# EAGLE board ESP32S3_DevBoard (EAGLE 9.6.2)
ERSTELLT_NAME: ESP32S3_DevBoard; PCBNAME: ESP32S3_DevBoard; PCBNUMMER: 20240115; PROJEKTNAME: ESP32S3_DevBoard; VERSION: v1.0
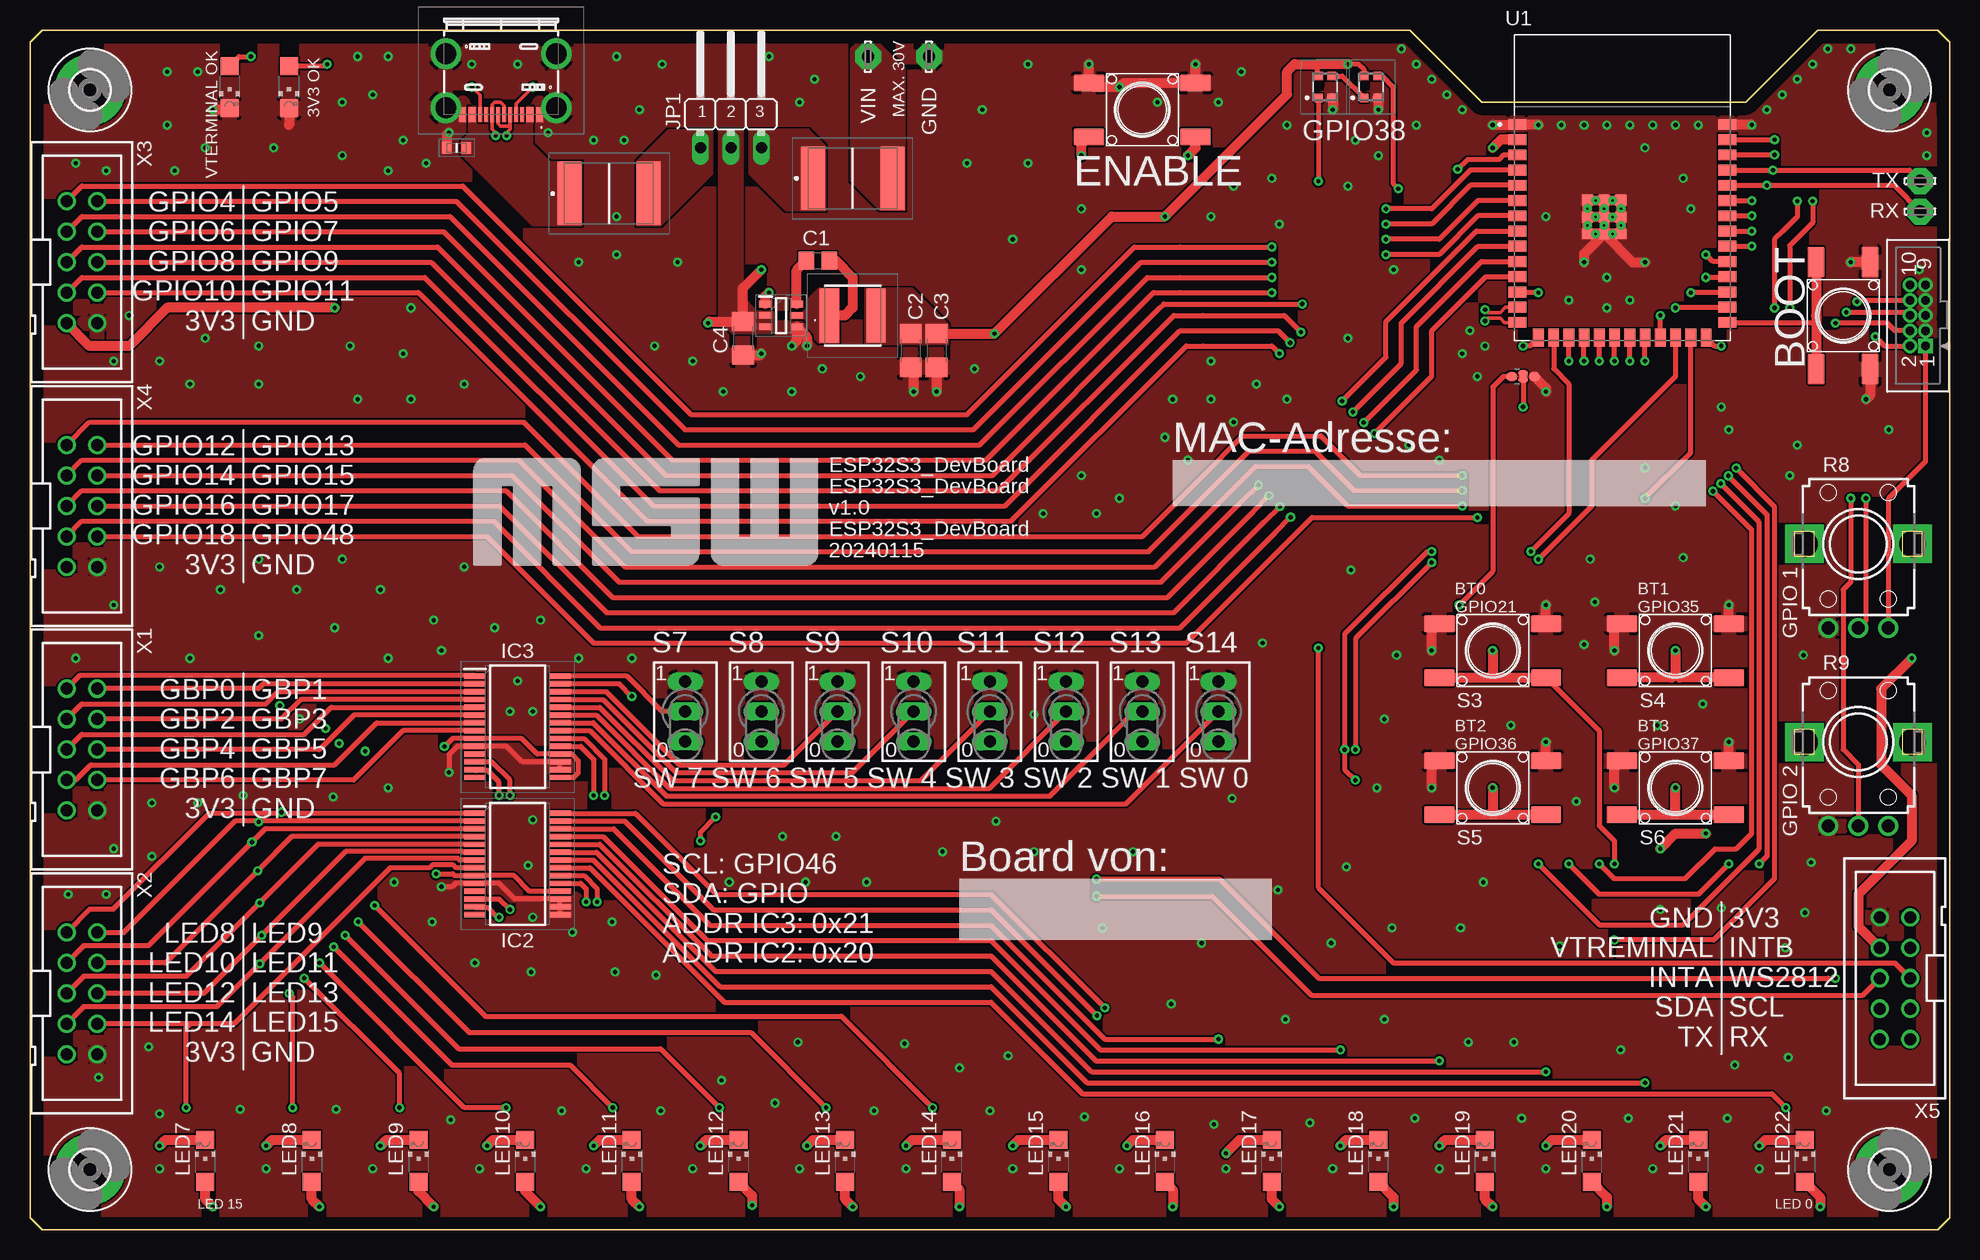
[diagram p3: board, top side]
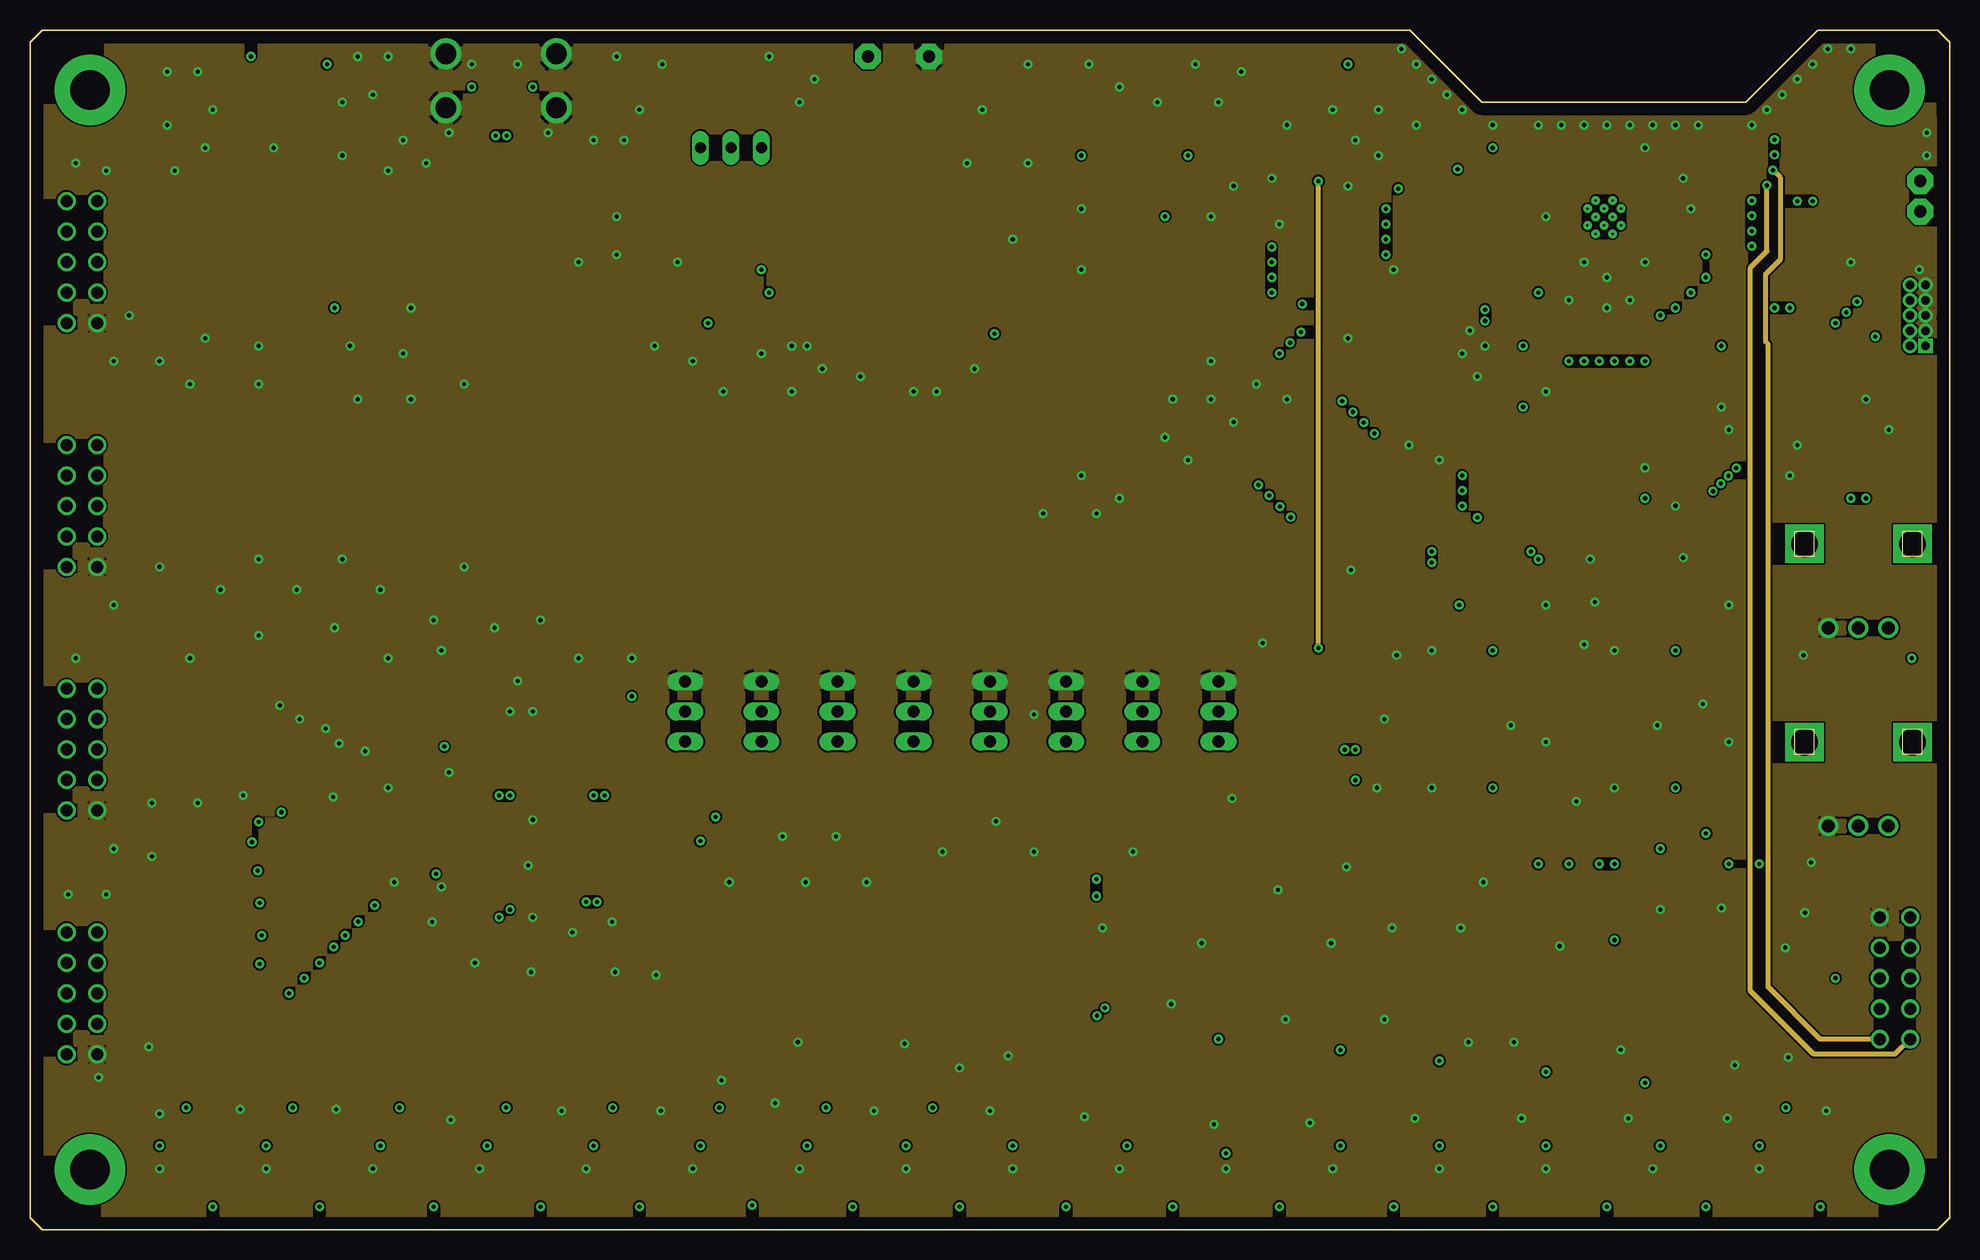
[diagram p4: board, inner layer Route2]
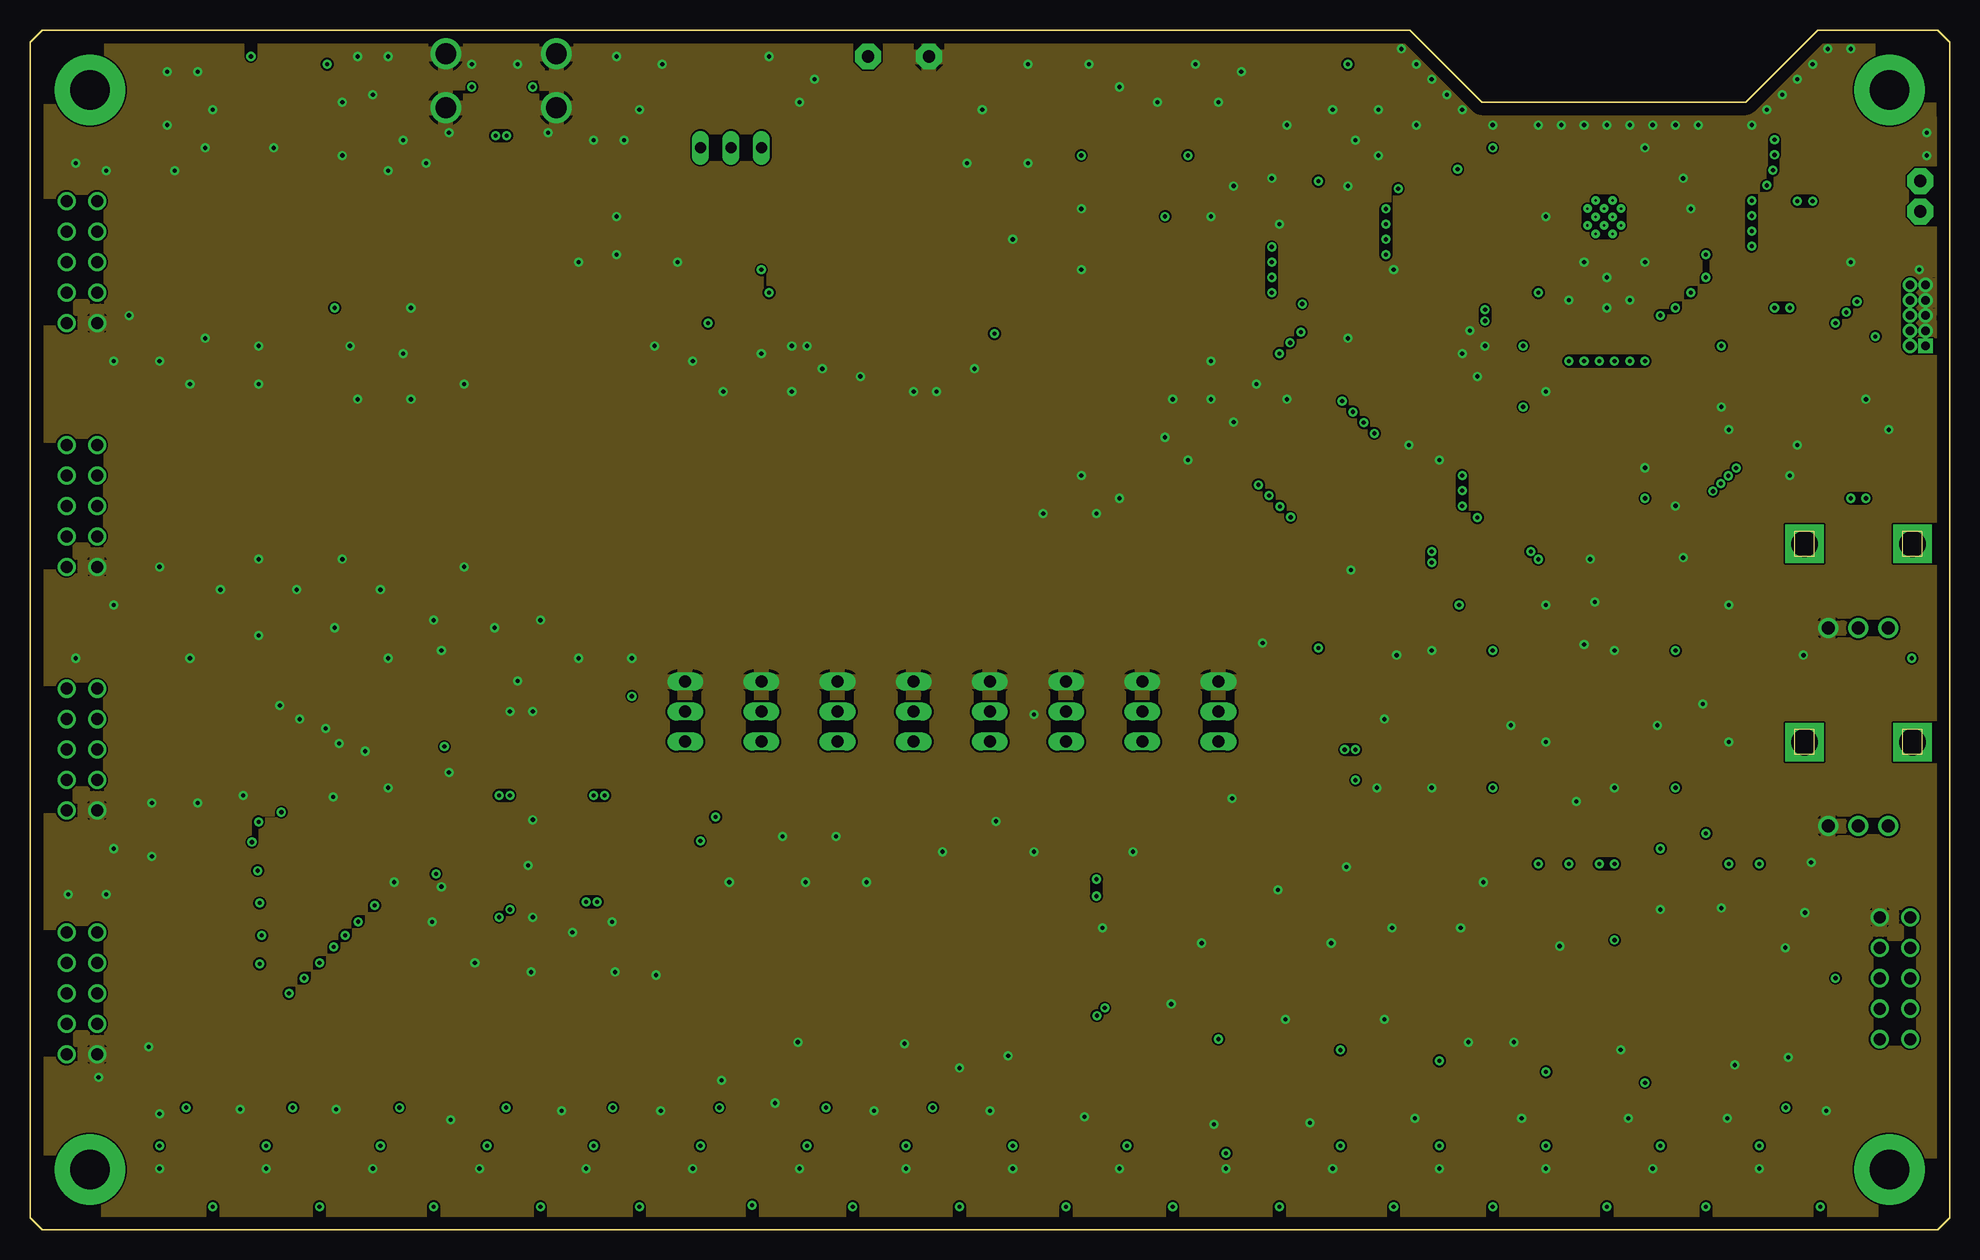
[diagram p5: board, inner layer Route15]
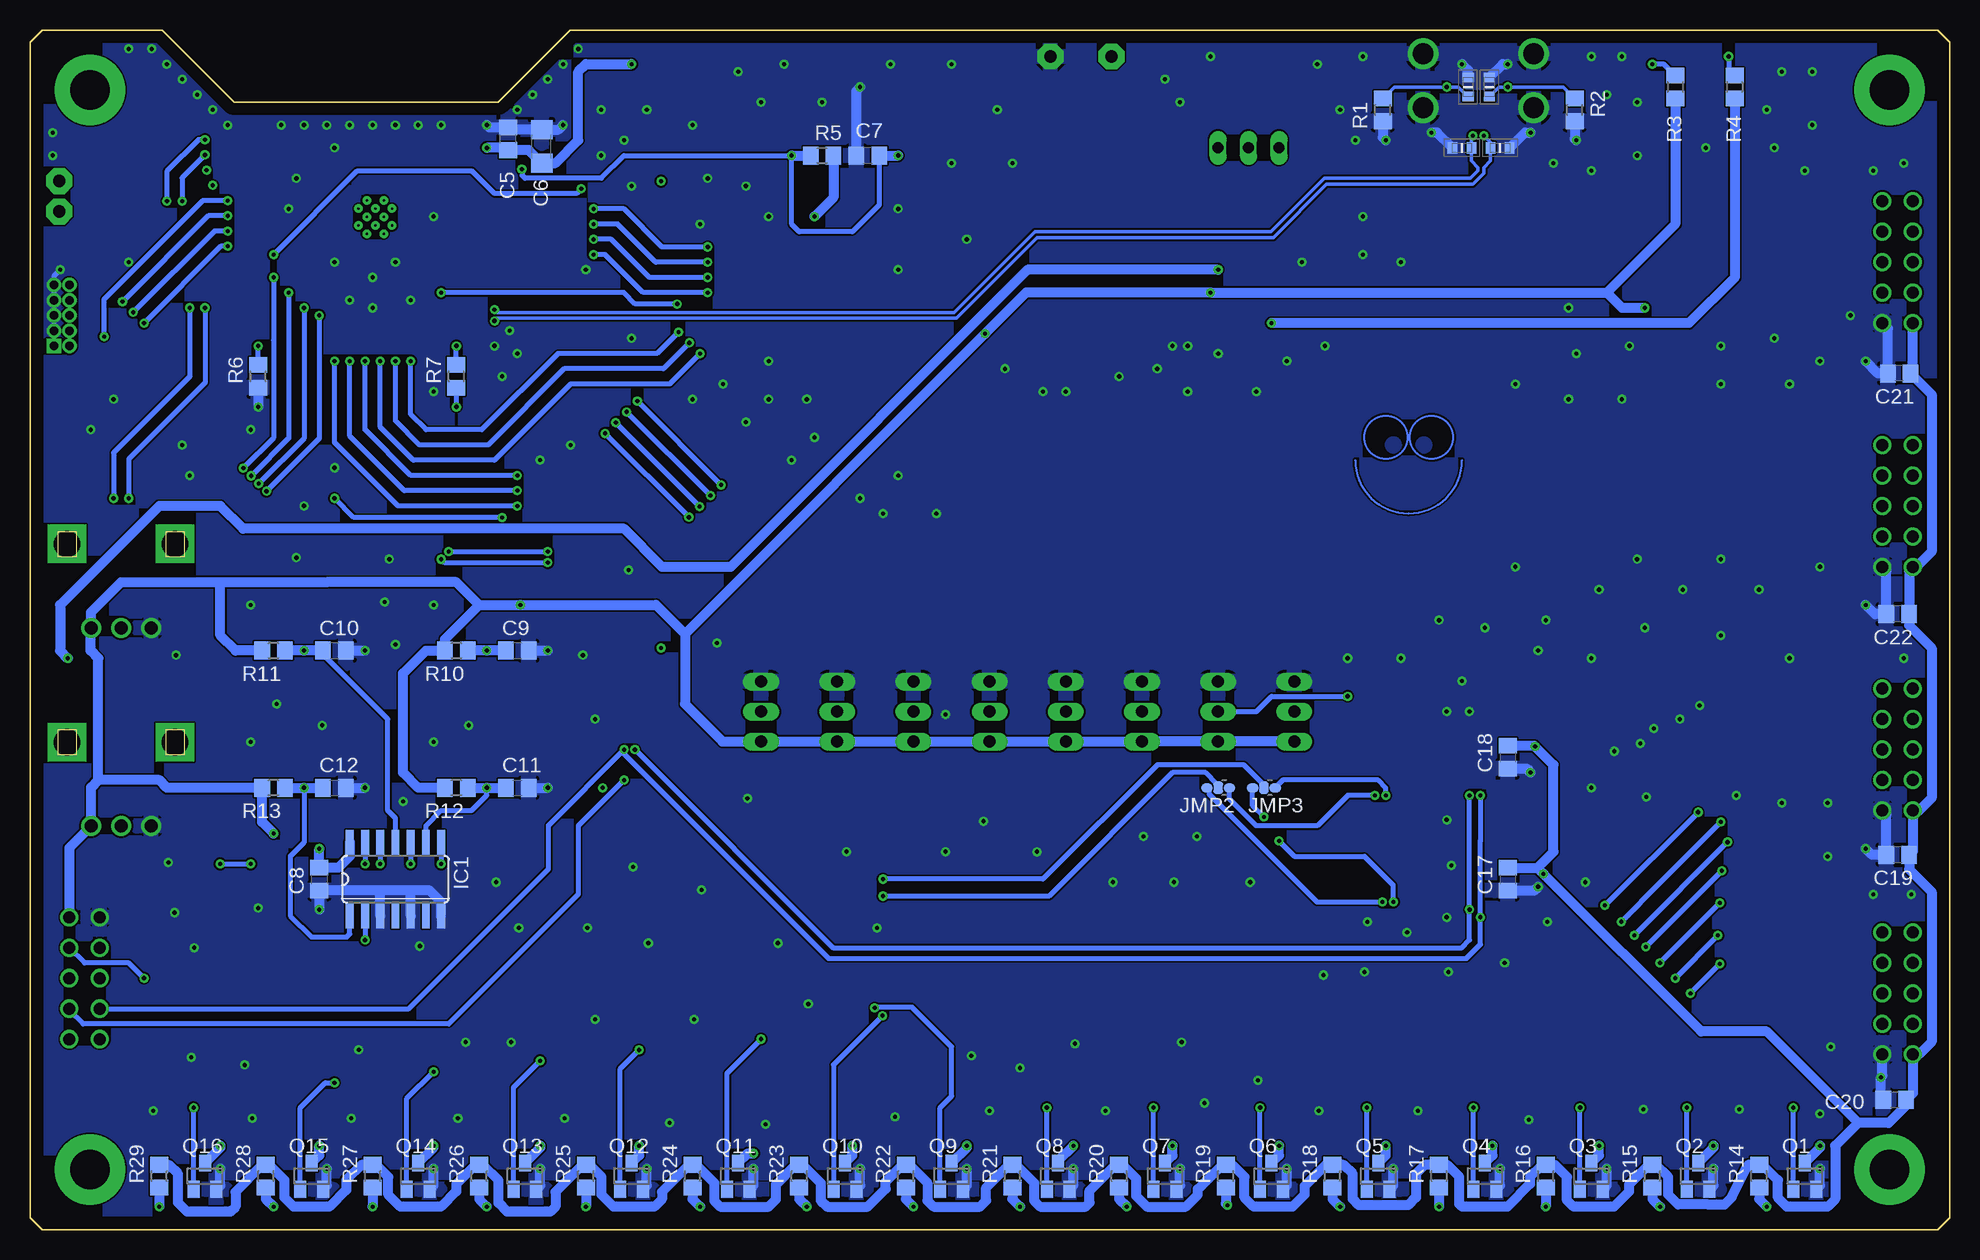
[diagram p6: board, bottom side, seen from below]

Size 160 x 100 mm. Coordinates in mm from the lower left corner, seen from the top.
Outline: 159,0 160,1 160,76 160,93 160,99 159,100 150,100 149,100 143,94 122,94 121,94 120,95 115,100 1,100 0,99 0,1 1,0 159,0
Copper layers (1+2*15+16): Top 0.035mm / dielectric 0.2104mm / Route2 0.0152mm / dielectric 1.065mm / Route15 0.0152mm / dielectric 0.2104mm / Bottom 0.035mm
Design rules "default *": minimum track width 6mil, minimum drill 0.35mm, track to track 6mil, track to pad 6mil, pad to pad 6mil, via to via 6mil, smd to smd 6mil, copper to edge 40mil, drill to drill 6mil, minimum pad ring 10mil, minimum via ring 8mil, stop-mask expansion 4mil, vias tented up to drill 22mil, thermal gap 10mil
Net classes: 1 diff pairs: width 0.203 mm, clearance 0.178 mm

## Footprints (pad centres in the part's own frame; a part is rotated, then mirrored left to right if it is on the bottom)
C0805 = smd 1.3 x 1.5: 1 -0.95,0; 2 0.95,0
C1206 = smd 1.6 x 1.8: 1 -1.4,0; 2 1.4,0
DIONC1608X70N = smd 0.8 x 0.95: 1 -0.8,0; 2 0.8,0
2920L030DR = smd 2 x 5.3: 1 -3.3,0; 2 3.3,0
LSP10 = drill 1.016 pad 2.159 octagon: MP 0,0
3,3-PAD = drill 3.3 pad 5.842: B3,3 0,0
SO14 = smd 0.66 x 2.032: 1 -3.81,-3.073; 2 -2.54,-3.073; 3 -1.27,-3.073; 4 0,-3.073; 5 1.27,-3.073; 6 2.54,-3.073; 7 3.81,-3.073; 8 3.81,3.073; 9 2.54,3.073; 10 1.27,3.073; 11 0,3.073; 12 -1.27,3.073; 13 -2.54,3.073; 14 -3.81,3.073
SOP65P780X200-28N = smd 1.8 x 0.45: 1 -3.55,4.225; 2 -3.55,3.575; 3 -3.55,2.925; 4 -3.55,2.275; 5 -3.55,1.625; 6 -3.55,0.975; 7 -3.55,0.325; 8 -3.55,-0.325; 9 -3.55,-0.975; 10 -3.55,-1.625; 11 -3.55,-2.275; 12 -3.55,-2.925; 13 -3.55,-3.575; 14 -3.55,-4.225; 15 3.55,-4.225; 16 3.55,-3.575; 17 3.55,-2.925; 18 3.55,-2.275; 19 3.55,-1.625; 20 3.55,-0.975; 21 3.55,-0.325; 22 3.55,0.325; 23 3.55,0.975; 24 3.55,1.625; 25 3.55,2.275; 26 3.55,2.925; 27 3.55,3.575; 28 3.55,4.225
USB480003A = smd 0.6 x 1.25: A1 -3.2,3.675; A4 -2.4,3.675; A9 2.4,3.675; A12 3.2,3.675 | smd 0.3 x 1.25: A5 -1.25,3.675; A6 -0.25,3.675; A7 0.25,3.675; A8 1.25,3.675; B5 1.75,3.675; B6 0.75,3.675; B7 -0.75,3.675; B8 -1.75,3.675 | drill 1.71 pad 2: MH3 -4.61,3.1; MH4 4.61,3.1 | drill 1.71 pad 2.565: MH5 -4.61,-1.4; MH6 4.61,-1.4
SAMTEC_FTS-105-01-L-D = drill 0.7 pad 1.067 square: 1 -5.08,-1.27 | drill 0.7 pad 1.067: 2 -5.08,0; 3 -3.81,-1.27; 4 -3.81,0; 5 -2.54,-1.27; 6 -2.54,0; 7 -1.27,-1.27; 8 -1.27,0; 9 0,-1.27; 10 0,0
C0R-JMP = smd 0.8 x 1: 1 0,0.938; 3 0,-0.938 | smd 1 x 0.8: 2 0,0
JP2W = drill 0.914 long: 1 -2.54,-1.27; 2 0,-1.27; 3 2.54,-1.27
74404052039 = smd 1.6 x 4.5: 1 -1.95,0; 2 1.95,0
CHIPLED_1206 = smd 1.5 x 1.5: A 0,-1.75; C 0,1.75
WS2812C2020 = smd 0.7 x 0.7: 1 0.915,-0.55; 2 0.915,0.55; 3 -0.915,0.55; 4 -0.915,-0.55
SOT95P280X100-6N = smd 1.05 x 0.55: 1 -1.3,0.95; 2 -1.3,0; 3 -1.3,-0.95; 4 1.3,-0.95; 5 1.3,0; 6 1.3,0.95
SOT23 = smd 1 x 1.4: 1 -0.95,-1.1; 2 0.95,-1.1; 3 0,1.1
R0805 = smd 1.3 x 1.5: 1 -0.95,0; 2 0.95,0
EVUF = drill 1.1 pad 1.676: 1 -2.5,-7; 2 0,-7; 3 2.5,-7 | drill 2.2 square: M1 4.5,0; M2 -4.5,0
TS42_4PAD = smd 2.54 x 1.4: 1 -4.454,2.25; 2 4.454,2.25; 3 -4.454,-2.25; 4 4.454,-2.25
SPDT_5MM = drill 1 pad 1.422 long: 1 0,-2.5; 2 0,0; 3 0,2.5
XCVR_ESP32S3WROOM1N8R8 = smd 1.5 x 0.9: 1 -8.75,5.26; 2 -8.75,3.99; 3 -8.75,2.72; 4 -8.75,1.45; 5 -8.75,0.18; 6 -8.75,-1.09; 7 -8.75,-2.36; 8 -8.75,-3.63; 9 -8.75,-4.9; 10 -8.75,-6.17; 11 -8.75,-7.44; 12 -8.75,-8.71; 13 -8.75,-9.98; 14 -8.75,-11.25; 27 8.75,-11.25; 28 8.75,-9.98; 29 8.75,-8.71; 30 8.75,-7.44; 31 8.75,-6.17; 32 8.75,-4.9; 33 8.75,-3.63; 34 8.75,-2.36; 35 8.75,-1.09; 36 8.75,0.18; 37 8.75,1.45; 38 8.75,2.72; 39 8.75,3.99; 40 8.75,5.26 | smd 0.9 x 1.5: 15 -6.985,-12.5; 16 -5.715,-12.5; 17 -4.445,-12.5; 18 -3.175,-12.5; 19 -1.905,-12.5; 20 -0.635,-12.5; 21 0.635,-12.5; 22 1.905,-12.5; 23 3.175,-12.5; 24 4.445,-12.5; 25 5.715,-12.5; 26 6.985,-12.5 | smd 0.9 x 0.9: 41_1 -1.5,-2.46; 41_2 -2.9,-2.46; 41_3 -0.1,-2.46; 41_4 -2.9,-3.86; 41_5 -1.5,-3.86; 41_6 -0.1,-3.86; 41_7 -2.9,-1.06; 41_8 -1.5,-1.06; 41_9 -0.1,-1.06 | drill 0.2 pad 0.4: 41_10 -1.5,-1.76; 41_11 -2.9,-1.76; 41_12 -0.1,-1.76; 41_13 -2.9,-3.16; 41_14 -1.5,-3.16; 41_15 -0.1,-3.16; 41_16 -2.2,-1.06; 41_17 -0.8,-1.06; 41_18 -2.2,-2.46; 41_19 -0.8,-2.46; 41_20 -2.2,-3.86; 41_21 -0.8,-3.86
PAK100/2500-10 = drill 1 pad 1.422: 1 -5.08,-1.27; 2 -5.08,1.27; 3 -2.54,-1.27; 4 -2.54,1.27; 5 0,-1.27; 6 0,1.27; 7 2.54,-1.27; 8 2.54,1.27; 9 5.08,-1.27; 10 5.08,1.27

## Placement (x,y rotation side)
C1  100n  [C0805]  65.66,80.77 0 top
C2  22u  [C1206]  73.41,73.28 270 top
C3  22u  [C1206]  75.56,73.28 270 top
C4  10u  [C1206]  59.44,74.3 270 top
C5  100n  [C0805]  120.14,90.93 90 bottom
C6  10u  [C1206]  117.35,90.3 90 bottom
C7  100n  [C0805]  90.17,89.53 180 bottom
C8  100n  [C0805]  135.89,29.21 270 bottom
C9  100n  [C0805]  119.38,48.26 0 bottom
C10  100n  [C0805]  134.62,48.26 0 bottom
C11  100n  [C0805]  119.38,36.83 0 bottom
C12  100n  [C0805]  134.62,36.83 0 bottom
C17  100n  [C0805]  36.83,29.21 270 bottom
C18  100n  [C0805]  36.83,39.37 270 bottom
C19  1u  [C0805]  4.32,31.24 180 bottom
C20  1u  [C0805]  4.57,10.79 180 bottom
C21  1u  [C0805]  4.19,71.37 180 bottom
C22  1u  [C0805]  4.32,51.31 180 bottom
D1  GG060305100N2P  [DIONC1608X70N]  40.13,95.25 90 bottom
D2  GG060305100N2P  [DIONC1608X70N]  37.47,90.17 0 bottom
D3  GG060305100N2P  [DIONC1608X70N]  40.64,90.17 180 bottom
D4  GG060305100N2P  [DIONC1608X70N]  35.56,90.17 180 top
D5  GG060305100N2P  [DIONC1608X70N]  38.35,95.25 90 bottom
F1  2.5A  [2920L030DR]  48.26,86.36 0 top
F2  2.5A  [2920L030DR]  68.58,87.63 0 top
GND  LSP10  [LSP10]  74.93,97.79 90 top
H1  MOUNT-PAD-ROUND3.3  [3,3-PAD]  5,95 0 top
H2  MOUNT-PAD-ROUND3.3  [3,3-PAD]  155,95 0 top
H3  MOUNT-PAD-ROUND3.3  [3,3-PAD]  155,5 0 top
H4  MOUNT-PAD-ROUND3.3  [3,3-PAD]  5,5 0 top
IC1  74HC14D  [SO14]  129.54,29.21 0 bottom
IC2  MCP23017T-E_SS  [SOP65P780X200-28N]  40.64,30.48 0 top
IC3  MCP23017T-E_SS  [SOP65P780X200-28N]  40.64,41.91 0 top
J1  USB4800-03-A  [USB480003A]  39.27,96.62 180 top
J2  3220-10-0100-00  [SAMTEC_FTS-105-01-L-D]  156.72,78.74 90 top
JMP1  0R-JUMPC  [C0R-JMP]  124.46,71.12 90 top
JMP2  0R-JUMPC  [C0R-JMP]  60.96,36.83 270 bottom
JMP3  0R-JUMPC  [C0R-JMP]  57.15,36.83 270 bottom
JP1  [JP2W]  58.42,91.44 0 top
L1  3u9  [74404052039]  68.58,76.2 0 top
LED1  gr  [CHIPLED_1206]  21.59,95.25 180 top
LED2  gr  [CHIPLED_1206]  16.64,95.25 180 top
LED3  WS2812C-2020  [WS2812C2020]  111.76,95.25 270 top
LED4  WS2812C-2020  [WS2812C2020]  107.95,95.25 270 top
LED7  rt  [CHIPLED_1206]  14.61,5.71 0 top
LED8  rt  [CHIPLED_1206]  23.5,5.71 0 top
LED9  rt  [CHIPLED_1206]  32.38,5.71 0 top
LED10  rt  [CHIPLED_1206]  41.27,5.71 0 top
LED11  rt  [CHIPLED_1206]  50.16,5.71 0 top
LED12  rt  [CHIPLED_1206]  59.05,5.71 0 top
LED13  rt  [CHIPLED_1206]  67.94,5.71 0 top
LED14  rt  [CHIPLED_1206]  76.83,5.71 0 top
LED15  rt  [CHIPLED_1206]  85.72,5.71 0 top
LED16  rt  [CHIPLED_1206]  94.61,5.71 0 top
LED17  rt  [CHIPLED_1206]  103.5,5.71 0 top
LED18  rt  [CHIPLED_1206]  112.39,5.71 0 top
LED19  rt  [CHIPLED_1206]  121.28,5.71 0 top
LED20  rt  [CHIPLED_1206]  130.18,5.71 0 top
LED21  rt  [CHIPLED_1206]  139.06,5.71 0 top
LED22  rt  [CHIPLED_1206]  147.96,5.71 0 top
PS1  AP63203WU-7  [SOT95P280X100-6N]  62.61,76.2 0 top
Q1  PMV20EN  [SOT23]  12.06,4.45 0 bottom
Q2  PMV20EN  [SOT23]  20.95,4.45 0 bottom
Q3  PMV20EN  [SOT23]  29.84,4.45 0 bottom
Q4  PMV20EN  [SOT23]  38.73,4.45 0 bottom
Q5  PMV20EN  [SOT23]  47.62,4.45 0 bottom
Q6  PMV20EN  [SOT23]  56.52,4.45 0 bottom
Q7  PMV20EN  [SOT23]  65.41,4.45 0 bottom
Q8  PMV20EN  [SOT23]  74.3,4.45 0 bottom
Q9  PMV20EN  [SOT23]  83.19,4.45 0 bottom
Q10  PMV20EN  [SOT23]  92.08,4.45 0 bottom
Q11  PMV20EN  [SOT23]  100.97,4.45 0 bottom
Q12  PMV20EN  [SOT23]  109.86,4.45 0 bottom
Q13  PMV20EN  [SOT23]  118.75,4.45 0 bottom
Q14  PMV20EN  [SOT23]  127.64,4.45 0 bottom
Q15  PMV20EN  [SOT23]  136.53,4.45 0 bottom
Q16  PMV20EN  [SOT23]  145.41,4.45 0 bottom
R1  5k1  [R0805]  47.24,93.34 90 bottom
R2  5k1  [R0805]  31.24,93.34 90 bottom
R3  1k  [R0805]  22.86,95.25 270 bottom
R4  1k  [R0805]  17.91,95.25 270 bottom
R5  100k  [R0805]  93.98,89.53 0 bottom
R6  5k1  [R0805]  140.97,71.12 90 bottom
R7  5k1  [R0805]  124.46,71.12 90 bottom
R8  10k  [EVUF]  152.4,57.15 0 top
R9  10k  [EVUF]  152.4,40.64 0 top
R10  10k  [R0805]  124.46,48.26 180 bottom
R11  10k  [R0805]  139.7,48.26 180 bottom
R12  10k  [R0805]  124.46,36.83 180 bottom
R13  10k  [R0805]  139.7,36.83 180 bottom
R14  510  [R0805]  15.88,4.45 90 bottom
R15  510  [R0805]  24.77,4.45 90 bottom
R16  510  [R0805]  33.66,4.45 90 bottom
R17  510  [R0805]  42.55,4.45 90 bottom
R18  510  [R0805]  51.44,4.45 90 bottom
R19  510  [R0805]  60.33,4.45 90 bottom
R20  510  [R0805]  69.22,4.45 90 bottom
R21  510  [R0805]  78.11,4.45 90 bottom
R22  510  [R0805]  87,4.45 90 bottom
R23  510  [R0805]  95.89,4.45 90 bottom
R24  510  [R0805]  104.78,4.45 90 bottom
R25  510  [R0805]  113.67,4.45 90 bottom
R26  510  [R0805]  122.56,4.45 90 bottom
R27  510  [R0805]  131.44,4.45 90 bottom
R28  510  [R0805]  140.34,4.45 90 bottom
R29  510  [R0805]  149.22,4.45 90 bottom
RX  LSP10  [LSP10]  157.56,84.87 180 top
S1  [TS42_4PAD]  92.71,93.34 0 top
S2  [TS42_4PAD]  151.13,76.2 270 top
S3  [TS42_4PAD]  121.92,48.26 0 top
S4  [TS42_4PAD]  137.16,48.26 0 top
S5  [TS42_4PAD]  121.92,36.83 0 top
S6  [TS42_4PAD]  137.16,36.83 0 top
S7  TL36POSPDT_5MM  [SPDT_5MM]  54.61,43.18 0 top
S8  TL36POSPDT_5MM  [SPDT_5MM]  60.96,43.18 0 top
S9  TL36POSPDT_5MM  [SPDT_5MM]  67.31,43.18 0 top
S10  TL36POSPDT_5MM  [SPDT_5MM]  73.66,43.18 0 top
S11  TL36POSPDT_5MM  [SPDT_5MM]  80.01,43.18 0 top
S12  TL36POSPDT_5MM  [SPDT_5MM]  86.36,43.18 0 top
S13  TL36POSPDT_5MM  [SPDT_5MM]  92.71,43.18 0 top
S14  TL36POSPDT_5MM  [SPDT_5MM]  99.06,43.18 0 top
TX  LSP10  [LSP10]  157.56,87.41 180 top
U1  ESP32-S3-WROOM-1-N8R8  [XCVR_ESP32S3WROOM1N8R8]  132.72,86.87 0 top
U$1  [PCB_BESCHRIFTUNG]  66.57,56.02 0 top
U$5  [PCB_LOGO_3_28MM5]  51.33,59.84 0 top
VIN  LSP10  [LSP10]  69.85,97.79 90 top
X1  2510-  [PAK100/2500-10]  4.32,40.01 270 top
X2  2510-  [PAK100/2500-10]  4.32,19.68 270 top
X3  2510-  [PAK100/2500-10]  4.32,80.64 270 top
X4  2510-  [PAK100/2500-10]  4.32,60.33 270 top
X5  2510-  [PAK100/2500-10]  155.45,20.95 90 top

## Tracks (layer width: path | path; a pad name or v marks a point on that pad's centre or on a via)
+3V3  (via drill 0.35)
  Top 0.406: LED4.4 107.31,96.25 107.31,97.16 | LED3.4 111.21,96.67 110.73,97.16 v109.86,97.16 | v34.54,40.26 35.22,40.94 IC3.9 40.98,40.94 42.28,39.63 IC3.18 45.17,39.63 45.72,39.08 45.72,38.1 45.3,37.69 IC3.15 | v33.84,29.65 35.24,29.65 35.39,29.5 36.83,29.5 | 36.83,29.5 IC2.9 | J2.1 157.99,64.01 154.9,60.92 R8.3 | JMP1.1 122.81,71.12 121.92,70.23 121.92,54.86 v119.13,52.07 | IC2.18 41.65,28.2 40.34,29.5 36.83,29.5
  Top 0.813: C3.1 v80.39,74.68 90.17,84.45 v94.61,84.45 104.78,94.61 104.78,96.52 105.41,97.16 107.31,97.16 v109.86,97.16 | U1.2 122.61,90.86 v121.92,90.17 | PS1.1 61.31,77.82 v61.59,78.11 | v25.4,76.83 11.43,76.83 8.26,73.66 4.95,73.66 X3.9 | v135.89,31.75 137.16,33.02 v139.7,33.02
  Bottom 0.813: v121.92,90.17 120.33,90.17 C5.1 118.43,89.98 C6.1 116.21,88.9 114.3,90.81 114.3,96.52 113.67,97.16 v109.86,97.16 | X3.9 3.05,71.57 C21.1 1.49,69.62 1.49,56.52 2.76,55.24 X4.9 3.37,54.92 C22.1 3.37,50.36 1.49,48.48 1.49,35.98 2.54,34.92 X1.9 3.05,31.56 C19.1 3.37,30.04 1.49,28.16 1.49,15.66 2.54,14.61 X2.9 3.05,11.37 C20.1 3.62,10.35 5.08,8.89 7.62,8.89 | 7.62,8.89 9.53,6.99 9.53,2.54 10.16,1.91 13.56,1.91 14.31,2.65 14.31,4.12 15.59,5.39 R14.2 16.8,5.39 18.16,2.67 18.74,2.09 20.11,2.09 22.64,2.09 23.46,2.91 23.46,4.38 24.48,5.39 R15.2 25.05,5.39 26.71,3.74 26.71,3.16 27.96,1.91 31.34,1.91 31.88,2.44 31.88,4.38 32.89,5.39 R16.2 33.95,5.39 34.96,4.38 34.96,3.79 36.85,1.91 40.64,1.91 40.85,2.12 40.85,4.38 41.87,5.39 R17.2 43.72,5.39 44.47,4.65 44.47,2.67 45.11,2.03 49.25,2.03 49.74,2.52 49.74,4.63 50.51,5.39 R18.2 51.98,5.39 53.76,3.61 53.76,2.91 54.76,1.91 58.02,1.91 58.76,2.65 58.76,4.38 59.78,5.39 R19.2 60.62,5.39 62.65,3.36 62.65,2.91 63.65,1.91 66.91,1.91 67.8,2.79 67.8,4.26 68.92,5.39 R20.2 69.5,5.39 71.67,3.23 71.67,2.25 72.01,1.91 75.8,1.91 76.3,2.41 76.3,3.88 77.81,5.39 R21.2 78.39,5.39 80.3,3.49 80.3,2.4 80.8,1.91 84.69,1.91 85.19,2.41 85.19,3.88 86.7,5.39 R22.2 87.28,5.39 88.69,4 88.69,3.39 90.17,1.91 93.58,1.91 94.08,2.41 94.08,3.88 95.59,5.39 R23.2 96.17,5.39 97.83,3.74 97.83,2.5 98.42,1.91 102.47,1.91 102.97,2.41 102.97,3.88 104.48,5.39 R24.2 105.06,5.39 107.31,3.15 107.31,2.54 107.95,1.91 111.36,1.91 112.36,2.91 112.36,4.38 113.38,5.39 R25.2 113.95,5.39 116.2,3.15 116.2,1.91 116.62,1.49 120.23,1.49 120.95,2.21 120.95,4.08 122.27,5.39 R26.2 122.84,5.39 124.46,3.78 124.46,3.17 125.73,1.91 129.13,1.91 130.14,2.91 130.14,4.38 131.16,5.39 R27.2 132.37,5.39 133.63,4.14 133.63,3.3 135.03,1.91 138.03,1.91 138.77,2.65 138.77,4.12 140.04,5.39 R28.2 140.62,5.39 142.88,3.15 142.88,1.91 143.29,1.49 146.9,1.49 147.66,2.25 147.66,4.63 148.43,5.39 R29.2
  Bottom 0.813: 7.62,8.89 15.24,16.51 20.7,16.51 v33.84,29.65 34.35,30.16 | C17.1 34.35,30.16 | 34.35,30.16 33.02,31.49 33.02,38.73 v34.54,40.26 34.6,40.32 C18.1 | 105.41,49.66 v80.39,74.68 76.97,78.11 v61.59,78.11 28.57,78.11 | 105.41,49.66 105.41,43.81 102.28,40.68 S14.1 S13.1 S12.1 S11.1 S10.1 S9.1 S8.1 S7.1 | 105.41,49.66 107.82,52.07 v119.13,52.07 122.56,52.07 | 122.56,52.07 125.41,49.22 R10.2 127,48.26 128.91,46.35 128.91,38.1 127.64,36.83 R12.2 | 122.56,52.07 124.46,53.98 135.25,53.98 144.15,53.98 | 144.15,53.98 152.4,53.98 154.9,51.48 R8.3 154.94,50.11 154.94,48.26 154.31,47.62 154.31,37.47 | R11.2 142.88,48.26 144.15,49.53 144.15,53.98 | 154.31,37.47 154.9,36.87 R9.3 156.72,31.82 X5.9 | 154.31,37.47 149.22,37.47 148.59,36.83 R13.2 140.65,33.97 v139.7,33.02 | IC1.14 133.35,31.11 134.31,30.16 C8.1 v135.89,31.75 | R5.2 93.03,86.04 v94.61,84.45 | R3.2 22.86,83.82 28.57,78.11 | 28.57,78.11 27.3,76.83 v25.4,76.83
  pour Top (no thermals): 69.72,78.49 73.53,78.49 76.45,75.56 76.58,75.44 76.58,73.79 69.6,73.79 69.6,78.49
BOOT
  Top 0.406: U1.27 148.83,75.62 148.88,75.56
  Top 0.813: S2.3 148.88,76.2 148.88,75.56 S2.4
BST
  Top 0.813: PS1.6 63.91,79.97 C1.1
BT0  (via drill 0.35)
  Top 0.406: U1.23 v135.89,76.2 | v140.28,61.55 143.51,58.32 143.51,33.02 142.24,31.75 140.46,31.75 137.97,29.26 132.03,29.26 v130.81,30.48
  Bottom 0.406: v140.28,61.55 135.89,65.94 v135.89,76.2 | IC1.12 v130.81,30.48
BT1  (via drill 0.35)
  Top 0.406: U1.28 141.41,76.83 v137.16,76.83 | v140.93,62.19 144.15,58.97 144.15,31.75 137.79,25.4 130.81,25.4 v125.73,30.48
  Bottom 0.406: v140.93,62.19 137.16,65.95 v137.16,76.83 | IC1.8 v125.73,30.48
BT2  (via drill 0.35)
  Top 0.406: U1.29 141.41,78.11 v138.43,78.11 | v141.57,62.83 144.78,59.62 144.78,31.11 v144.15,30.48 | v141.6,30.48 139.06,27.94 130.81,27.94 v128.27,30.48
  Bottom 0.406: v141.57,62.83 138.43,65.97 v138.43,78.11 | IC1.10 v128.27,30.48 | v144.15,30.48 v141.6,30.48
BT3  (via drill 0.35)
  Top 0.406: U1.30 141.41,79.38 v139.7,79.38 | v142.21,63.47 145.41,60.27 145.41,29.21 140.34,24.13 v132.08,24.13
  Bottom 0.406: v139.7,79.38 139.7,74.14 139.7,65.99 v142.21,63.47 | IC1.2 v132.08,24.13
CC1  (via drill 0.35)
  Top 0.305: v41.91,95.25 40.52,93.86 J1.A5
  Bottom 0.305: D1.1 40.93,95.25 v41.91,95.25 46.29,95.25 R1.2
CC2  (via drill 0.35)
  Top 0.305: v36.83,95.25 37.52,94.56 J1.B5
  Bottom 0.305: R2.2 32.2,95.25 v36.83,95.25 37.55,95.25 D5.1
DEBUG_SEL  (via drill 0.35)
  Top 0.406: U1.15 125.02,73.66 v124.46,73.66
  Bottom 0.406: R7.2 v124.46,73.66
ENABLE  (via drill 0.35)
  Top 0.406: v119,88.39 119.81,89.21 122.44,89.21 122.82,89.59 U1.3
  Top 0.813: v96.52,89.53 97.16,90.18 S1.4 | v87.63,89.53 87.63,90.47 S1.3
  Bottom 0.406: v119,88.39 119,87.88 118.75,87.63 112.39,87.63 110.49,89.53 v96.52,89.53 96.52,83.82 95.89,83.19 91.44,83.19 89.22,85.41 C7.1
  Bottom 0.813: v96.52,89.53 R5.1 | C7.1 v87.63,89.53
GND  (via drill 0.35)
  Top 0.406: v34.92,38.1 34.92,39.6 35.61,40.28 IC3.10 39.73,40.28 41.02,38.98 IC3.17 IC3.16 | v34.29,28.57 35.18,28.57 35.46,28.86 IC2.10 39.09,28.86 40.39,27.55 IC2.17 IC2.16 IC2.15
  Top 0.813: LED2.C 16.48,93.34 v15.24,93.34 | D4.2 34.76,91.28 v34.92,91.44 | C4.2 60.83,72.89 v60.96,73.03 | v63.5,73.66 63.91,74.07 PS1.4 64.77,74.39 v64.77,73.66 | C2.2 73.66,71.62 v73.66,69.85 | C3.2 v75.56,69.85 | S2.2 153.38,69.56 v153.03,69.22 | S2.1 151.77,80.65 v151.76,80.64 | LED4.2 108.58,94.25 v108.58,93.34 | LED3.2 112.39,94.25 v112.39,93.34 | v125.73,92.08 125.68,92.13 U1.1 123.91,92.08 v121.92,92.08 | JMP1.3 126.36,70.15 v126.36,69.85 | S4.2 141.61,52.06 v141.6,52.07 | v132.08,48.26 132.08,49.88 S4.1 | v116.84,48.26 116.84,49.88 S3.1 | S3.2 126.37,52.06 v126.36,52.07 | v116.84,36.83 116.84,38.45 S5.1 | S5.2 126.37,40.63 v126.36,40.64 | v132.08,36.83 132.08,38.45 S6.1 | S6.2 141.61,40.63 v141.6,40.64 | LED1.C 21.59,92.08 | v97.16,97.16 97.16,95.6 S1.2 91.15,95.59 v90.81,95.25 88.6,95.25 S1.1 88.26,97.15 v88.27,97.16 | U1.40 143.46,92.13 v143.51,92.08 | U1.41_8 U1.41_7 U1.41_2 | U1.41_8 U1.41_9 U1.41_3 | U1.41_3 U1.41_6 U1.41_5 | U1.41_5 U1.41_4 U1.41_2 | U1.41_1 U1.41_2 | U1.41_1 U1.41_5 | U1.41_1 U1.41_3 | U1.41_1 U1.41_8 | U1.41_5 129.54,81.33 v129.54,80.64 | U1.41_5 133.58,80.64 v134.62,80.64
  Bottom 0.406: J2.3 J2.5 J2.7 J2.9 157.99,79.5 v157.48,80.01
  Bottom 0.813: R2.1 31.24,90.93 v31.11,90.81 | D2.2 35.4,91.44 v34.92,91.44 | D3.2 42.71,91.44 v43.18,91.44 | D1.2 40.13,96.65 v40.64,97.16 | D5.2 37.25,97.16 v36.83,97.16 | R1.1 47.24,91.06 v46.99,90.81 | C7.2 91.12,94.94 v90.81,95.25 | v115.57,92.08 115.95,91.7 C6.2 119.96,91.7 C5.2 121.73,91.88 v121.92,92.08 | R6.1 v140.97,68.58 | C10.2 v132.08,48.26 | C9.2 v116.84,48.26 | C11.2 v116.84,36.83 | C12.2 v132.08,36.83 | v135.89,26.67 C8.2 130.81,28.26 | Q16.2 144.15,3.67 v144.15,5.08 | Q15.2 135.25,3.67 v135.25,5.08 | Q14.2 126.36,3.67 v126.36,5.08 | Q13.2 117.47,3.67 v117.47,5.08 | Q12.2 108.58,3.67 v108.58,5.08 | Q11.2 99.69,3.67 v99.69,5.08 | Q10.2 90.81,3.67 v90.81,5.08 | Q9.2 81.92,3.67 v81.92,5.08 | Q8.2 73.03,3.67 v73.03,5.08 | Q7.2 64.14,3.67 v64.14,5.08 | Q6.2 55.24,3.67 v55.24,5.08 | Q5.2 46.35,3.67 v46.35,5.08 | Q4.2 37.47,3.67 v37.47,5.08 | Q3.2 28.57,3.67 v28.57,5.08 | Q2.2 19.68,3.67 v19.68,5.08 | Q1.2 10.79,3.67 v10.79,5.08 | C20.2 5.71,10.99 v5.71,12.7 5.59,12.83 X2.10 | v6.99,31.75 6.48,31.24 C19.2 5.27,34.6 X1.10 | v6.99,52.07 6.22,51.31 C22.2 5.27,54.92 X4.10 | v6.99,72.39 5.97,71.37 C21.2 5.14,75.12 X3.10 | C18.2 35.24,38.42 v34.92,38.1 | C17.2 34.6,28.26 v34.29,28.57 | IC1.7 125.73,27.3 126.69,28.26 128.27,28.26 | 128.27,28.26 130.81,28.26 | IC1.3 130.81,28.26 | IC1.5 128.27,28.26
  other vias: 79.38,93.34 114.3,98.42 115.57,97.16 116.84,95.89 118.11,94.61 119.38,93.34 127.64,92.08 129.54,92.08 131.44,92.08 133.35,92.08 135.25,92.08 137.16,92.08 139.06,92.08 144.78,93.34 146.05,94.61 147.32,95.89 148.59,97.16 149.86,98.42 151.76,98.42 158.12,91.44 158.12,89.53 83.19,97.16 83.19,88.9 78.11,88.9 81.92,82.55 87.63,85.09 87.63,80.01 98.42,84.45 100.33,87 104.14,83.82 103.5,87.63 109.86,87 110.49,90.81 112.39,89.53 104.78,92.08 99.06,93.98 93.98,93.98 100.97,96.52 126.36,84.45 128.27,77.47 131.44,76.83 131.44,79.38 133.35,77.47 137.79,87.63 134.62,90.17 138.43,85.09 154.94,66.67 147.32,65.41 146.69,62.87 141.6,66.67 134.62,63.5 137.16,60.33 114.94,65.41 117.47,64.14 119.38,73.03 121.28,73.66 120.65,71.12 109.86,74.3 98.42,72.39 102.23,70.48 104.78,69.22 100.33,67.31 95.25,69.22 98.42,69.22 96.52,64.14 94.61,66.04 87.63,62.87 84.45,59.69 88.9,59.69 90.81,60.96 69.22,71.12 78.74,71.75 63.5,69.85 66.04,71.75 57.78,69.85 55.24,72.39 52.07,73.66 48.9,81.28 45.72,80.64 53.98,80.64 50.8,93.34 48.9,84.45 49.53,90.81 48.9,97.79 52.7,97.16 61.59,97.79 65.41,95.89 64.14,93.98 33.02,88.9 29.84,88.27 26.04,89.53 28.57,94.61 27.3,97.79 29.84,97.79 26.04,93.98 20.32,90.17 11.43,96.52 13.97,96.52 11.43,92.08 14.61,90.17 12.06,88.27 3.81,88.9 6.35,88.27 10.79,72.39 8.26,76.2 14.61,74.3 13.34,70.48 19.05,70.48 19.05,73.66 31.11,73.03 31.75,76.83 36.2,70.48 26.67,73.66 27.3,69.22 31.75,69.22 120.02,74.93 113.67,80.01 10.79,55.24 3.81,47.62 13.34,47.62 15.88,53.34 19.05,49.53 19.05,55.88 25.4,50.16 22.23,53.34 29.21,53.34 26.04,55.88 29.84,47.62 33.66,50.8 34.29,48.26 38.73,50.16 36.2,55.24 50.16,47.62 45.72,47.62 42.55,50.8 40.64,45.72 41.91,43.18 40.01,43.18 29.84,36.83 27.94,39.88 25.78,40.51 24.64,41.78 22.48,42.55 20.83,43.69 10.16,35.56 3.17,27.94 6.35,27.94 10.16,31.11 13.97,35.56 17.78,36.2 25.27,36.07 33.53,25.65 30.35,28.96 37.08,22.23 41.91,34.16 41.53,30.35 41.91,26.04 48.51,25.65 45.21,24.77 41.78,21.46 48.77,21.46 52.2,21.21 72.9,15.49 77.47,13.46 81.53,14.48 80.01,9.91 87.88,9.4 98.68,8.76 106.68,8.89 9.91,15.24 10.79,9.65 17.53,10.03 25.53,10.03 35.05,9.14 44.32,9.91 52.58,9.91 62.1,10.54 57.66,12.45 64.01,15.62 70.36,9.91 115.44,9.27 124.33,9.27 133.22,9.27 141.48,9.27 149.73,9.91 142.11,13.72 146.56,14.35 132.59,14.99 119.89,15.62 123.7,15.62 112.9,17.53 104.65,17.53 95.12,18.8 97.66,23.88 89.41,25.15 62.74,32.77 67.18,32.77 58.29,28.96 64.64,28.96 69.72,28.96 76.07,31.5 80.52,34.04 83.69,31.5 83.69,42.93 91.95,31.5 100.2,35.94 104.01,28.32 108.46,23.88 113.54,25.15 109.73,30.23 119.25,25.15 121.16,28.96 112.27,36.83 112.9,42.55 102.74,48.9 110.11,54.99 113.92,47.88 123.44,42.04 135.64,42.04 128.91,35.69 140.97,26.8 139.45,43.81 129.54,48.77 130.43,52.32 147.83,47.88 137.79,56.01 130.05,55.88 147.96,26.42 148.46,30.61 146.3,23.5 127.51,23.62
  pour Top (rank 2, no thermals): 63.37,75.56 63.37,74.55 62.99,74.17 62.87,74.04 62.87,73.41 63.25,73.03 65.02,73.03 65.28,73.28 65.28,74.17 64.77,74.68 64.64,74.8 64.64,75.56
  pour Top (rank 2, no thermals): 36.32,93.47 36.32,91.44 35.31,90.42 35.31,89.66 34.42,89.66 33.15,90.93 35.69,93.47
  pour Top (rank 2, no thermals): 42.16,91.31 42.16,93.6 42.93,93.6 43.81,92.71 43.81,91.06 43.56,90.81 42.67,90.81
  pour Bottom (rank 2): -2.54,101.6 165.1,101.6 165.1,-3.81 -2.54,-3.81
  pour Route15 (rank 2): -2.54,101.6 165.1,101.6 165.1,-3.81 -2.54,-3.81
  pour Route2 (rank 2): -2.54,101.6 165.1,101.6 165.1,-3.81 -2.54,-3.81
  pour Top (rank 2): -2.54,101.6 165.1,101.6 165.1,-3.81 -2.54,-3.81
GPB0
  Top 0.406: X1.1 4.16,46.2 37.03,46.2 IC3.1
GPB1
  Top 0.406: X1.2 19.05,45.09 19.45,45.48 IC3.2
GPB2
  Top 0.406: X1.3 4.32,43.81 19.68,43.81 20.7,44.84 IC3.3
GPB3
  Top 0.406: X1.4 20.95,42.55 22.59,44.19 IC3.4
GPB4
  Top 0.406: X1.5 4.32,41.27 22.86,41.27 25.12,43.53 IC3.5
GPB5
  Top 0.406: X1.6 24.13,40.01 27.01,42.88 IC3.6
GPB6
  Top 0.406: X1.7 3.81,37.47 5.08,38.73 25.4,38.73 28.9,42.23 IC3.7
GPB7
  Top 0.406: IC3.8 31.11,41.59 27,37.47 X1.8
GPIO4  (via drill 0.35)
  Top 0.406: X3.1 4.32,87 36.07,87 55.12,67.94 78.11,67.94 92.08,81.92 95.89,81.92 v103.5,81.92 | U1.4 120.07,88.32 116.84,85.09 v113.03,85.09
  Bottom 0.406: v103.5,81.92 107.31,81.92 110.49,85.09 v113.03,85.09
GPIO5  (via drill 0.35)
  Top 0.406: X3.2 35.54,85.72 54.59,66.67 78.63,66.67 92.6,80.64 95.89,80.64 v103.5,80.64 | U1.5 120.07,87.05 116.84,83.82 v113.03,83.82
  Bottom 0.406: v103.5,80.64 107.84,80.64 111.02,83.82 v113.03,83.82
GPIO6  (via drill 0.35)
  Top 0.406: X3.3 4.32,84.45 35.02,84.45 54.06,65.41 79.16,65.41 93.13,79.38 95.89,79.38 v103.5,79.38 | U1.6 120.7,85.78 117.47,82.55 v113.03,82.55
  Bottom 0.406: v103.5,79.38 108.37,79.38 111.54,82.55 v113.03,82.55
GPIO7  (via drill 0.35)
  Top 0.406: X3.4 34.49,83.19 53.54,64.14 79.68,64.14 93.65,78.11 95.89,78.11 v103.5,78.11 | U1.7 120.7,84.51 117.47,81.28 v113.03,81.28
  Bottom 0.406: v103.5,78.11 108.89,78.11 112.07,81.28 v113.03,81.28
GPIO8  (via drill 0.35)
  Top 0.406: X3.5 4.32,81.92 33.96,81.92 53.01,62.87 80.21,62.87 94.18,76.83 94.51,77.16 v106.05,77.16 | v125.73,78.11 124.02,78.11 U1.12
  Bottom 0.406: v106.05,77.16 109.55,77.16 110.49,78.11 v125.73,78.11
GPIO9  (via drill 0.35)
  Top 0.406: X3.6 33.44,80.64 52.49,61.59 80.73,61.59 95.34,76.2 97.79,76.2 104.56,76.2 v105.94,74.82 | v128.27,72.39 U1.17
  Bottom 0.406: v105.94,74.82 107.73,73.03 115.99,73.03 122.34,66.67 127,66.67 128.27,67.94 v128.27,72.39
GPIO10  (via drill 0.35)
  Top 0.406: X3.7 4.32,79.38 32.91,79.38 51.96,60.33 81.26,60.33 95.87,74.93 97.79,74.93 104.03,74.93 v105.04,73.92 | U1.18 | v129.54,72.39 U1.18
  Bottom 0.406: v105.04,73.92 107.21,71.75 115.46,71.75 121.81,65.41 127.53,65.41 129.54,67.42 v129.54,72.39
GPIO11  (via drill 0.35)
  Top 0.406: X3.8 32.38,78.11 51.44,59.05 81.79,59.05 96.39,73.66 97.79,73.66 103.5,73.66 v104.14,73.03 | U1.19 | v130.81,72.39 U1.19
  Bottom 0.406: v104.14,73.03 106.68,70.48 114.94,70.48 121.28,64.14 128.05,64.14 130.81,66.89 v130.81,72.39
GPIO12  (via drill 0.35)
  Top 0.406: X4.1 4.95,67.31 41.15,67.31 50.67,57.78 92.71,57.78 98.42,63.5 100.33,65.41 101.07,66.15 107.62,66.15 110.91,62.87 v119.38,62.87 | v132.08,72.39 U1.20
  Bottom 0.406: v132.08,72.39 132.08,66.67 128.27,62.87 v119.38,62.87
GPIO13  (via drill 0.35)
  Top 0.406: X4.2 41.26,65.41 50.15,56.52 93.24,56.52 99.32,62.6 101.23,64.51 101.6,64.88 107.1,64.88 110.38,61.59 v119.38,61.59 | U1.21 | v133.35,72.39 U1.21
  Bottom 0.406: v133.35,72.39 133.35,66.15 128.8,61.59 v119.38,61.59
GPIO14  (via drill 0.35)
  Top 0.406: X4.3 4.32,64.14 40.73,64.14 49.62,55.24 93.76,55.24 100.22,61.7 102.13,63.61 106.57,63.61 109.86,60.33 v119.38,60.33 | U1.22 | v134.62,72.39 U1.22
  Bottom 0.406: v134.62,72.39 134.62,65.62 129.32,60.33 v119.38,60.33
GPIO15  (via drill 0.35)
  Top 0.406: X4.4 40.2,62.87 49.09,53.98 94.29,53.98 101.12,60.81 v102.39,62.08 | v109.37,69.06 113.03,72.72 113.03,75.69 120.58,83.24 U1.8
  Bottom 0.406: v102.39,62.08 v109.37,69.06
GPIO16  (via drill 0.35)
  Top 0.406: X4.5 4.32,61.59 39.68,61.59 48.57,52.7 94.81,52.7 102.02,59.91 v103.29,61.18 | v110.27,68.16 114.3,72.19 114.3,75.56 120.7,81.97 U1.9
  Bottom 0.406: v103.29,61.18 v110.27,68.16
GPIO17  (via drill 0.35)
  Top 0.406: X4.6 39.15,60.33 48.04,51.44 95.34,51.44 102.92,59.01 v104.19,60.28 | v111.17,67.27 115.57,71.67 115.57,75.28 120.99,80.7 U1.10
  Bottom 0.406: v104.19,60.28 v111.17,67.27
GPIO18  (via drill 0.35)
  Top 0.406: X4.7 4.32,59.05 38.63,59.05 47.52,50.16 95.87,50.16 103.81,58.11 v105.08,59.38 | v112.07,66.37 116.84,71.14 116.84,74.93 121.34,79.43 U1.11
  Bottom 0.406: v105.08,59.38 v112.07,66.37
GPIO48  (via drill 0.35)
  Top 0.406: X4.8 38.1,57.78 46.99,48.9 96.39,48.9 104.71,57.21 106.85,59.36 v120.65,59.36 | v134.62,60.96 138.43,64.77 U1.25
  Bottom 0.406: v120.65,59.36 133.02,59.36 v134.62,60.96
I2C_SCL  (via drill 0.35)
  Top 0.406: U1.16 127,71.75 128.27,70.48 128.27,59.69 v125.09,56.52 | v116.84,56.52 116.46,56.52 109.58,49.63 v109.58,40.01 109.58,38.37 v110.49,37.47 | IC2.12 39.12,27.55 v40.01,26.67 | v40.01,36.2 40.01,37.47 38.48,38.98 IC3.12
  Bottom 0.406: v125.09,56.52 v116.84,56.52 | v109.58,40.01 93.07,23.5 40.64,23.5 40.01,24.13 v40.01,26.67 v40.01,36.2 | v110.49,37.47 114.3,33.66 114.3,27.94 125.09,17.14 155.57,17.14 156.72,18.29 X5.3
I2C_SDA  (via drill 0.35)
  Top 0.406: U1.24 137.16,71.12 130.18,64.14 130.18,60.31 v125.74,55.87 | v116.84,55.61 110.49,49.26 v110.49,40.01 | IC2.13 37.16,26.84 38.14,26.84 38.94,26.04 v39.12,26.04 | IC3.13 37.16,38.27 38.14,38.27 39.1,37.31 v39.1,36.2
  Bottom 0.406: v125.74,55.87 125.47,55.61 v116.84,55.61 | X5.4 128.43,18.41 116.79,30.05 116.79,33.71 v110.49,40.01 110.49,39.63 93.45,22.59 40.26,22.59 39.1,23.75 39.1,26.02 v39.12,26.04 39.12,32.41 39.1,32.38 v39.1,36.2
INTA1  (via drill 0.35)
  Top 0.406: IC2.20 46.17,29.5 47.26,28.41 v47.26,27.3
  Bottom 0.406: JMP2.3 61.72,36.65 61.72,36.3 52.72,27.3 v47.26,27.3
INTA2  (via drill 0.35)
  Top 0.406: IC3.20 46.17,40.94 47.9,39.21 v47.9,36.2
  Bottom 0.406: v47.9,36.2 50.16,36.2 52.7,33.66 57.78,33.66 60.02,35.89 JMP2.1
INTB1  (via drill 0.35)
  Top 0.406: IC2.19 45.9,28.86 46.35,28.4 v46.35,27.3 | v55.88,32.38 55.88,33.12 v57.15,34.39
  Bottom 0.406: v46.35,27.3 46.35,28.7 48.77,31.11 54.61,31.11 v55.88,32.38 | v57.15,34.39 58.09,35.33 JMP3.3
INTB2  (via drill 0.35)
  Top 0.406: IC3.19 45.9,40.28 46.99,39.2 v46.99,36.2
  Bottom 0.406: v46.99,36.2 46.99,36.83 47.62,37.47 55.58,37.47 JMP3.1
LED0  (via drill 0.35)
  Top 0.406: IC2.21 46.68,30.16 57.89,18.95 80.11,18.95 87.73,11.33 145.19,11.33 v146.37,10.16
  Bottom 0.406: Q16.1 v146.37,10.16
LED1  (via drill 0.35)
  Top 0.406: IC2.22 46.95,30.8 57.52,20.23 80.11,20.23 88.11,12.24 v134.62,12.24
  Bottom 0.406: Q15.1 137.47,10.16 135.4,12.24 v134.62,12.24
LED2  (via drill 0.35)
  Top 0.406: IC2.23 47.22,31.45 57.16,21.52 80.11,21.52 88.48,13.15 v126.36,13.15
  Bottom 0.406: v126.36,13.15 128.59,10.93 Q14.1
LED3  (via drill 0.35)
  Top 0.406: IC2.24 47.49,32.1 56.79,22.8 80.12,22.8 88.86,14.06 v117.47,14.06
  Bottom 0.406: v117.47,14.06 119.69,11.84 Q13.1
LED4  (via drill 0.35)
  Top 0.406: IC2.25 47.76,32.76 56.43,24.09 80.12,24.09 89.23,14.97 v109.22,14.97
  Bottom 0.406: v109.22,14.97 110.81,13.38 Q12.1
LED5  (via drill 0.35)
  Top 0.406: IC2.26 48.66,33.41 56.7,25.37 80.12,25.37 89.61,15.88 v99.06,15.88
  Bottom 0.406: v99.06,15.88 101.92,13.02 Q11.1
LED6  (via drill 0.35)
  Top 0.406: IC2.27 49.57,34.05 56.97,26.66 80.12,26.66 v88.95,17.83
  Bottom 0.406: v88.95,17.83 93.03,13.75 Q10.1
LED7  (via drill 0.35)
  Top 0.406: IC2.28 50.47,34.7 57.23,27.94 80.12,27.94 v89.59,18.47
  Bottom 0.406: Q9.1 84.14,10.16 83.19,11.11 83.19,15.24 86.5,18.56 89.25,18.56 89.34,18.47 v89.59,18.47
LED8  (via drill 0.35)
  Top 0.406: X2.1 5,26.71 6.94,26.71 14.94,34.7 20.95,34.7 | IC2.1 20.95,34.7 | 20.95,34.7 v20.95,34.79 | v28.72,27.02 37.96,17.78 67.62,17.78 v75.25,10.16
  Bottom 0.406: Q8.1 v75.25,10.16 | v20.95,34.79 v28.72,27.02
LED9  (via drill 0.35)
  Top 0.406: IC2.2 19.05,34.05 | 19.05,34.05 17.11,34.05 7.82,24.77 X2.2 | 19.05,34.05 v19.05,33.97 | v27.35,25.66 36.58,16.43 60.09,16.43 v66.36,10.16
  Bottom 0.406: Q7.1 v66.36,10.16 | v19.05,33.97 24.14,28.89 24.14,28.88 v27.35,25.66
LED10  (via drill 0.35)
  Top 0.406: X2.3 4.48,23.66 9.86,23.66 17.87,31.66 v18.5,32.3 19.61,33.41 IC2.3 | v26.28,24.52 35.72,15.08 52.55,15.08 v57.47,10.16
  Bottom 0.406: Q6.1 v57.47,10.16 | v18.5,32.3 v26.28,24.52
LED11  (via drill 0.35)
  Top 0.406: IC2.4 21.83,32.76 v18.99,29.91 11.3,22.23 X2.4 | v25.32,23.57 35.16,13.73 45.01,13.73 v48.58,10.16
  Bottom 0.406: Q5.1 v48.58,10.16 | v18.99,29.91 22.23,26.66 v25.32,23.57
LED12  (via drill 0.35)
  Top 0.406: X2.5 4.48,21.11 13.03,21.11 v19.14,27.22 24.02,32.1 IC2.5 | v39.69,10.16 36.2,10.16 v24.13,22.23
  Bottom 0.406: Q4.1 v39.69,10.16 | v24.13,22.23 v19.14,27.22
LED13  (via drill 0.35)
  Top 0.406: IC2.6 36.07,31.45 36.02,31.5 26.3,31.5 v19.3,24.51 14.48,19.68 X2.6 | v30.8,10.16 30.8,13.02 v22.86,20.95
  Bottom 0.406: Q3.1 v30.8,10.16 | v22.86,20.95 v19.3,24.51
LED14  (via drill 0.35)
  Top 0.406: IC2.7 35.8,30.8 35.66,30.95 27.94,30.95 v19.14,22.14 15.57,18.57 4.48,18.57 X2.7 | v21.91,10.16 21.91,19.37 v21.59,19.68
  Bottom 0.406: Q2.1 v21.91,10.16 | v21.59,19.68 v19.14,22.14
LED15  (via drill 0.35)
  Top 0.406: IC2.8 35.53,30.16 35.3,30.39 33.54,30.39 33.31,30.16 30.03,30.16 17.02,17.14 13.34,17.14 | 13.34,17.14 X2.8 | v13.02,10.16 13.02,16.82 13.34,17.14
  Bottom 0.406: Q1.1 v13.02,10.16
N$1
  pour Top (no thermals): 72.9,84.96 70.87,84.96 68.45,87.38 68.45,98.42 69.34,99.31 70.36,99.31 72.9,96.77 72.9,90.3
N$2  (via drill 0.35)
  Top 0.406: LED2.A 17.43,97.79 v18.41,97.79
  Bottom 0.406: v18.41,97.79 18.41,96.71 R4.1
N$3  (via drill 0.35)
  Top 0.406: JMP1.2 v124.46,68.58
  Bottom 0.406: R7.1 v124.46,68.58
N$4  (via drill 0.35)
  Top 0.406: v24.77,97.16 24.61,97 LED1.A
  Bottom 0.406: R3.1 23.82,97.16 v24.77,97.16
N$5  (via drill 0.35)
  Top 0.406: S3.4 130.81,41.57 130.81,33.66 132.08,32.38 v132.08,30.48
  Top 0.813: S3.3 121.92,46.01 | 121.92,46.01 S3.4 | v121.92,48.26 121.92,46.01
  Bottom 0.406: IC1.13 v132.08,30.48
  Bottom 0.813: C9.1 v121.92,48.26 R10.1
N$6  (via drill 0.35)
  Top 0.813: S5.4 121.92,34.58 | 121.92,34.58 S5.3 | v121.92,36.83 121.92,34.58
  Bottom 0.406: IC1.9 127,33.66 125.73,34.92 123.19,34.92 121.92,36.2 v121.92,36.83
  Bottom 0.813: R12.1 v121.92,36.83 C11.1
N$7  (via drill 0.35)
  Top 0.813: v137.16,48.26 137.16,46.35 | 137.16,46.35 136.81,46.01 S4.3 | S4.4 137.5,46.01 137.16,46.35
  Bottom 0.406: IC1.11 129.54,34.29 130.18,34.92 130.18,42.55 135.57,47.94 C10.1
  Bottom 0.813: C10.1 v137.16,48.26 R11.1
N$8  (via drill 0.35)
  Top 0.813: S6.4 137.16,34.58 | 137.16,34.58 S6.3 | 137.16,34.58 v137.16,36.83
  Bottom 0.406: v137.16,36.83 137.16,32.26 138.3,31.11 138.3,26.16 136.53,24.38 133.6,24.38 133.35,24.64 IC1.1
  Bottom 0.813: R13.1 v137.16,36.83 C12.1
N$9  (via drill 0.35)
  Top 0.813: v73.03,6.99 73.5,7.46 LED14.C
  Bottom 0.813: Q8.3 74.3,5.71 v73.03,6.99
N$10
  Top 0.406: LED4.3 109.38,96.17 LED3.1
N$11  (via drill 0.35)
  Top 0.406: v88.9,27.79 98.58,27.79 106.83,19.54 152.76,19.54 X5.6
  Bottom 0.406: JMP2.2 61.04,36.91 61.04,37.14 62,38.1 64.77,38.1 75.08,27.79 v88.9,27.79
N$12  (via drill 0.35)
  Top 0.406: v88.9,29.21 99.16,29.21 107.42,20.95 149.86,20.95 v150.5,20.95
  Bottom 0.406: JMP3.2 57.23,36.91 57.23,37.14 58.82,38.73 66.04,38.73 75.56,29.21 v88.9,29.21 | v150.5,20.95 151.76,22.23 155.45,22.23 X5.7
N$13  (via drill 0.35)
  Top 0.813: v77.47,1.91 77.47,3.33 LED14.A
  Bottom 0.813: R21.1 78.11,2.54 v77.47,1.91
N$14
  Bottom 0.152: 49.53,64.14 arc-180 40.64,64.14
N$15  (via drill 0.35)
  Top 0.813: v81.92,6.99 82.39,7.46 LED15.C
  Bottom 0.813: Q9.3 81.92,6.82 v81.92,6.99
N$16  (via drill 0.35)
  Top 0.813: v86.36,1.91 85.72,2.54 LED15.A
  Bottom 0.813: R22.1 87,2.54 v86.36,1.91
N$17
  pour Top (no thermals): 50.55,89.03 53.21,91.69 56.9,91.69 56.9,88.01 52.58,83.69 50.55,83.69
N$18  (via drill 0.35)
  Top 0.813: v91.44,6.99 91.92,7.46 LED16.C
  Bottom 0.813: Q10.3 91.44,6.18 v91.44,6.99
N$19  (via drill 0.35)
  Top 0.813: LED16.A 95.25,3.33 v95.25,1.91
  Bottom 0.813: R23.1 95.89,2.54 v95.25,1.91
N$20
  pour Top (no thermals): 66.29,84.96 66.29,90.3 64.9,91.69 59.94,91.69 59.94,88.01 62.99,84.96
N$21  (via drill 0.35)
  Top 0.813: v99.69,6.35 100.81,7.46 LED17.C
  Bottom 0.813: Q11.3 100.16,6.35 v99.69,6.35
N$22  (via drill 0.35)
  Top 0.813: v104.14,1.91 103.5,2.54 LED17.A
  Bottom 0.813: R24.1 104.78,2.54 v104.14,1.91
N$23
  pour Bottom: 43.18,65.41 arc-90 43.81,66.04 arc-90 44.45,65.41 arc-90 43.81,64.77 arc-90
N$24  (via drill 0.35)
  Top 0.813: v109.22,6.99 109.7,7.46 LED18.C
  Bottom 0.813: Q12.3 109.22,6.18 v109.22,6.99
N$25  (via drill 0.35)
  Top 0.813: v113.67,1.91 113.67,2.69 LED18.A
  Bottom 0.813: R25.1 v113.67,1.91
N$26
  pour Bottom: 46.35,66.04 arc-90 46.99,65.41 arc-90 46.35,64.77 arc-90 45.72,65.41 arc-90
N$27  (via drill 0.35)
  Top 0.813: v117.47,6.99 117.95,7.46 LED19.C
  Bottom 0.813: Q13.3 117.47,6.82 v117.47,6.99
N$28  (via drill 0.35)
  Top 0.813: v121.92,1.91 121.28,2.54 LED19.A
  Bottom 0.813: R26.1 122.56,2.54 v121.92,1.91
N$30  (via drill 0.35)
  Top 0.813: v126.36,6.99 126.84,7.46 LED20.C
  Bottom 0.813: Q14.3 126.36,6.82 v126.36,6.99
N$31  (via drill 0.35)
  Top 0.813: LED20.A 131.44,2.69 v131.44,1.91
  Bottom 0.813: R27.1 v131.44,1.91
N$33  (via drill 0.35)
  Top 0.813: v135.89,6.99 136.37,7.46 LED21.C
  Bottom 0.813: Q15.3 135.89,6.18 v135.89,6.99
N$34  (via drill 0.35)
  Top 0.813: v139.7,1.91 139.06,2.54 LED21.A
  Bottom 0.813: R28.1 140.34,2.54 v139.7,1.91
N$36  (via drill 0.35)
  Top 0.813: v144.15,6.99 144.62,7.46 LED22.C
  Bottom 0.813: Q16.3 144.15,6.82 v144.15,6.99
N$37  (via drill 0.35)
  Top 0.813: v149.22,1.91 149.22,2.69 LED22.A
  Bottom 0.813: R29.1 v149.22,1.91
N$39  (via drill 0.35)
  Top 0.813: v64.77,6.99 65.25,7.46 LED13.C
  Bottom 0.813: Q7.3 64.77,6.18 v64.77,6.99
N$40  (via drill 0.35)
  Top 0.813: v68.58,1.91 67.94,2.54 LED13.A
  Bottom 0.813: R20.1 69.22,2.54 v68.58,1.91
N$42  (via drill 0.35)
  Top 0.813: v55.88,6.99 56.36,7.46 LED12.C
  Bottom 0.813: Q6.3 55.88,6.18 v55.88,6.99
N$43  (via drill 0.35)
  Top 0.813: LED12.A 60.2,2.82 v60.2,2.03
  Bottom 0.813: R19.1 60.33,2.16 v60.2,2.03
N$45  (via drill 0.35)
  Top 0.813: v46.99,6.99 47.47,7.46 LED11.C
  Bottom 0.813: Q5.3 46.99,6.18 v46.99,6.99
N$46  (via drill 0.35)
  Top 0.813: v50.8,1.91 50.16,2.54 LED11.A
  Bottom 0.813: R18.1 51.44,2.54 v50.8,1.91
N$48  (via drill 0.35)
  Top 0.813: v38.1,6.99 38.58,7.46 LED10.C
  Bottom 0.813: Q4.3 38.1,6.18 v38.1,6.99
N$49  (via drill 0.35)
  Top 0.813: v42.55,1.91 41.27,3.17 LED10.A
  Bottom 0.813: R17.1 v42.55,1.91
N$51  (via drill 0.35)
  Top 0.813: v29.21,6.99 29.69,7.46 LED9.C
  Bottom 0.813: Q3.3 29.21,6.18 v29.21,6.99
N$52  (via drill 0.35)
  Top 0.813: v33.66,1.91 32.38,3.17 LED9.A
  Bottom 0.813: R16.1 v33.66,1.91
N$54  (via drill 0.35)
  Top 0.813: v19.68,6.99 20.16,7.46 LED8.C
  Bottom 0.813: Q2.3 19.68,6.82 v19.68,6.99
N$55  (via drill 0.35)
  Top 0.813: v24.13,1.91 23.5,2.54 LED8.A
  Bottom 0.813: R15.1 24.77,2.54 v24.13,1.91
N$57  (via drill 0.35)
  Top 0.813: v10.79,6.99 11.28,7.46 LED7.C
  Bottom 0.813: Q1.3 10.79,6.82 v10.79,6.99
N$58  (via drill 0.35)
  Top 0.813: v15.24,1.91 14.61,2.54 LED7.A
  Bottom 0.813: R14.1 15.88,2.54 v15.24,1.91
POT0  (via drill 0.35)
  Top 0.406: U1.39 v145.41,90.86 | v148.59,85.72 148.59,83.93 146.95,82.29 146.69,82.02 v146.69,76.83 | v153.03,60.96 153.03,50.78 R8.2
  Bottom 0.406: v145.41,90.86 145.94,90.86 148.59,88.21 v148.59,85.72 | v146.69,76.83 146.69,71.12 153.03,64.77 v153.03,60.96
POT1  (via drill 0.35)
  Top 0.406: U1.38 v145.41,89.59 | v147.32,85.72 147.32,84.45 146.05,83.19 145.41,82.55 v145.41,76.83 | v151.76,60.96 151.76,53.98 151.13,53.34 151.13,40.01 152.4,38.73 R9.2
  Bottom 0.406: v145.41,89.59 147.32,87.68 v147.32,85.72 | v145.41,76.83 145.41,70.59 151.76,64.24 v151.76,60.96
RX  (via drill 0.35)
  Top 0.406: RX.MP 155.38,87.05 v144.78,87.05 U1.36
  Route2 0.406: X5.1 155.45,14.61 148.7,14.61 143.41,19.89 143.41,80.18 144.78,81.55 v144.78,87.05
SW
  Top 0.813: C1.2 67.18,80.77 68.58,79.38 68.58,76.83 67.94,76.2 L1.1
  pour Top (no thermals): 63.37,76.45 64.39,76.45 64.77,76.83 64.77,76.96 64.77,77.47 65.79,78.49 67.44,78.49 67.44,73.91 65.79,73.91 64.9,74.8 64.9,75.56 64.52,75.95 63.37,75.95
SW0
  Top 0.406: IC3.21 46.68,41.59 52.78,35.48 91.36,35.48 S14.2
SW1
  Top 0.406: IC3.22 46.95,42.23 53.05,36.13 85.03,36.13 90.17,41.27 92.08,43.18 S13.2
SW2
  Top 0.406: IC3.23 47.22,42.88 53.32,36.78 79.97,36.78 S12.2
SW3
  Top 0.406: IC3.24 47.49,43.53 53.59,37.44 74.27,37.44 S11.2
SW4
  Top 0.406: IC3.25 47.76,44.19 53.86,38.09 68.56,38.09 S10.2
SW5
  Top 0.406: IC3.26 45.72,44.84 48.03,44.84 54.13,38.73 62.87,38.73 S9.2
SW6  (via drill 0.35)
  Top 0.406: v50.16,44.45 49.13,45.48 IC3.27
  Bottom 0.406: S8.2 57.78,43.18 56.52,44.45 v50.16,44.45
SW7
  Top 0.406: S7.2 52.7,43.18 49.75,46.13 IC3.28
TCK  (via drill 0.35)
  Top 0.406: U1.32 v143.51,81.97 | J2.4 155.45,74.93 154.81,75.56 v150.5,75.56
  Bottom 0.406: v143.51,81.97 144.09,81.97 v150.5,75.56
TDI  (via drill 0.35)
  Top 0.406: U1.34 v143.51,84.51 | v152.29,77.36 152.4,77.47 J2.8
  Bottom 0.406: v143.51,84.51 145.14,84.51 v152.29,77.36
TDO  (via drill 0.35)
  Top 0.406: U1.33 v143.51,83.24 | v151.39,76.46 156.46,76.46 J2.6
  Bottom 0.406: v143.51,83.24 144.62,83.24 v151.39,76.46
TMS  (via drill 0.35)
  Top 0.406: U1.35 v143.51,85.78 | v153.82,74.45 154.61,73.66 J2.2
  Bottom 0.406: v153.82,74.45 153.82,77.55 145.59,85.78 v143.51,85.78
TX  (via drill 0.35)
  Top 0.406: U1.37 v145.29,88.32 156.65,88.32 TX.MP
  Route2 0.406: X5.2 149.22,15.88 144.88,20.22 144.88,73.79 144.68,73.99 144.68,79.66 145.92,80.9 145.92,87.68 v145.29,88.32
USB_D_N  (via drill 0.35)
  Top 0.305: J1.A7 39.04,92.93 39.04,92.75 39.04,92.74 39.04,92.18 39.23,91.99 39.81,91.99 40,92.18 40,92.37 40.02,92.39 J1.B7 40.02,91.71 39.74,91.43 v39.74,91.19 | v121.28,76.68 121.51,76.45 122.56,76.45 122.99,76.89 U1.13
  Bottom 0.305: v39.74,91.19 39.84,91.08 D3.1 39.84,89.08 39.29,88.54 39.29,88.27 39.93,87.63 52.12,87.63 56.56,83.19 76.25,83.19 82.98,76.45 121.06,76.45 v121.28,76.68
USB_D_P  (via drill 0.35)
  Top 0.305: J1.A6 39.52,93.7 39.24,93.98 38.73,93.98 38.52,93.77 J1.B6 38.52,91.71 38.8,91.43 v38.8,91.19 | v121.28,75.75 121.51,75.97 122.56,75.97 122.91,75.62 U1.14
  Bottom 0.305: v38.8,91.19 38.27,90.65 D2.1 38.27,89.08 38.81,88.54 38.81,88.06 39.73,87.15 51.92,87.15 56.36,82.7 76.05,82.7 82.78,75.97 121.06,75.97 v121.28,75.75
VDD_SPI  (via drill 0.35)
  Top 0.406: U1.26 140.41,73.66 v140.97,73.66
  Bottom 0.406: R6.2 v140.97,73.66
VFUSE
  pour Top (no thermals): 36.58,93.6 37.21,93.6 37.21,92.33 41.4,92.33 41.4,93.6 41.91,93.6 41.91,90.42 43.31,89.03 45.97,89.03 45.97,83.69 41.91,83.69 35.94,89.66 35.94,90.68 36.58,91.31
VTERMINAL  (via drill 0.35)
  Top 0.813: v60.96,80.01 59.44,78.49 C4.1 56.65,75.69 v56.52,75.56 | v156.84,47.62 154.31,45.09 154.31,38.73 156.84,36.2 156.84,32.38 152.4,27.94 152.4,25.27 X5.8
  Bottom 0.813: v60.96,80.01 76.83,80.01 101.6,55.24 107.31,55.24 110.49,58.42 142.24,58.42 144.15,60.33 149.22,60.33 157.48,52.07 157.48,48.26 v156.84,47.62 | R4.2 17.91,79.38 21.72,75.56 v56.52,75.56
  pour Top (no thermals): 57.4,91.69 57.4,75.82 58.55,74.68 61.85,74.68 61.98,74.8 61.98,76.45 61.85,76.58 60.58,76.58 59.44,77.72 59.44,91.69
WS2812_IN  (via drill 0.35)
  Top 0.406: U1.31 140.28,80.7 v139.7,81.28 | v114.05,86.77 113.67,87.15 113.67,95.25 112.75,96.17 LED3.3
  Bottom 0.406: v139.7,81.28 132.72,88.27 123.19,88.27 121.28,86.36 114.45,86.36 v114.05,86.77
WS2812_OUT  (via drill 0.35)
  Top 0.406: X5.5 155.45,22.23 113.67,22.23 107.4,28.49 v107.4,48.49 | LED4.1 v107.4,87.4
  Route2 0.406: v107.4,48.49 v107.4,87.4
(copper drawn outside any net)
  shapes: Bottom circle x2

## Text on the board
tPlace: 3V3 OK | MAX. 30V | GPIO38 | ENABLE | VTERMINAL OK | BOOT | GPIO4 / GPIO6 / GPIO8 / GPIO10 / 3V3 | GPIO5 / GPIO7 / GPIO9 / GPIO11 / GND | MAC-Adresse: | GPIO12 / GPIO14 / GPIO16 / GPIO18 / 3V3 | GPIO13 / GPIO15 / GPIO17 / GPIO48 / GND | GPIO 1 | BT0 / GPIO21 | BT1 / GPIO35 | BT2 / GPIO36 | BT3 / GPIO37 | GPIO 2 | SW 7 SW 6 SW 5 SW 4 SW 3 SW 2 SW 1 SW 0 | GBP0 / GBP2 / GBP4 / GBP6 / 3V3 | GBP1 / GBP3 / GBP5 / GBP7 / GND | Board von: | SCL: GPIO46 / SDA: GPIO / ADDR IC3: 0x21 / ADDR IC2: 0x20 | GND / VTREMINAL / INTA / SDA / TX | 3V3 / INTB / WS2812 / SCL / RX | LED8 / LED10 / LED12 / LED14 / 3V3 | LED9 / LED11 / LED13 / LED15 / GND | LED 15 | LED 0